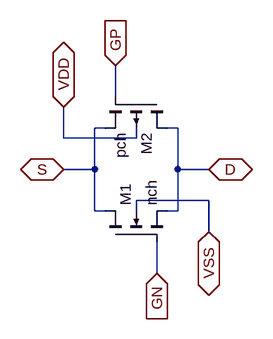
[diagram p0: schematic trans.asc]
trans.asc, the LTspice schematic file:
Version 4
SHEET 1 880 680
WIRE 224 16 224 -32
WIRE 208 64 192 64
WIRE 320 64 304 64
WIRE 144 80 144 32
WIRE 256 80 256 64
WIRE 256 80 144 80
WIRE 192 128 192 64
WIRE 192 128 144 128
WIRE 320 128 320 64
WIRE 368 128 320 128
WIRE 368 176 256 176
WIRE 192 192 192 128
WIRE 208 192 192 192
WIRE 256 192 256 176
WIRE 320 192 320 128
WIRE 320 192 304 192
WIRE 368 224 368 176
WIRE 288 288 288 240
FLAG 224 -32 GP
IOPIN 224 -32 In
FLAG 288 288 GN
IOPIN 288 288 In
FLAG 144 128 S
IOPIN 144 128 BiDir
FLAG 368 128 D
IOPIN 368 128 BiDir
FLAG 368 224 VSS
IOPIN 368 224 BiDir
FLAG 144 32 VDD
IOPIN 144 32 BiDir
SYMBOL nmos4 208 240 R270
SYMATTR InstName M1
SYMATTR Value nch
SYMATTR Value2 l=ln w=wn
SYMBOL pmos4 304 16 R90
SYMATTR InstName M2
SYMATTR Value pch
SYMATTR Value2 l=lp w=wp

The netlist it stands for:
* trans.asc
M1 S GN D VSS nch l=ln w=wn
M2 D GP S VDD pch l=lp w=wp
.model NMOS NMOS
.model PMOS PMOS
.lib standard.mos
.backanno
.end